# Altium schematic sheet 02.SchDoc
size 386 x 246 mm
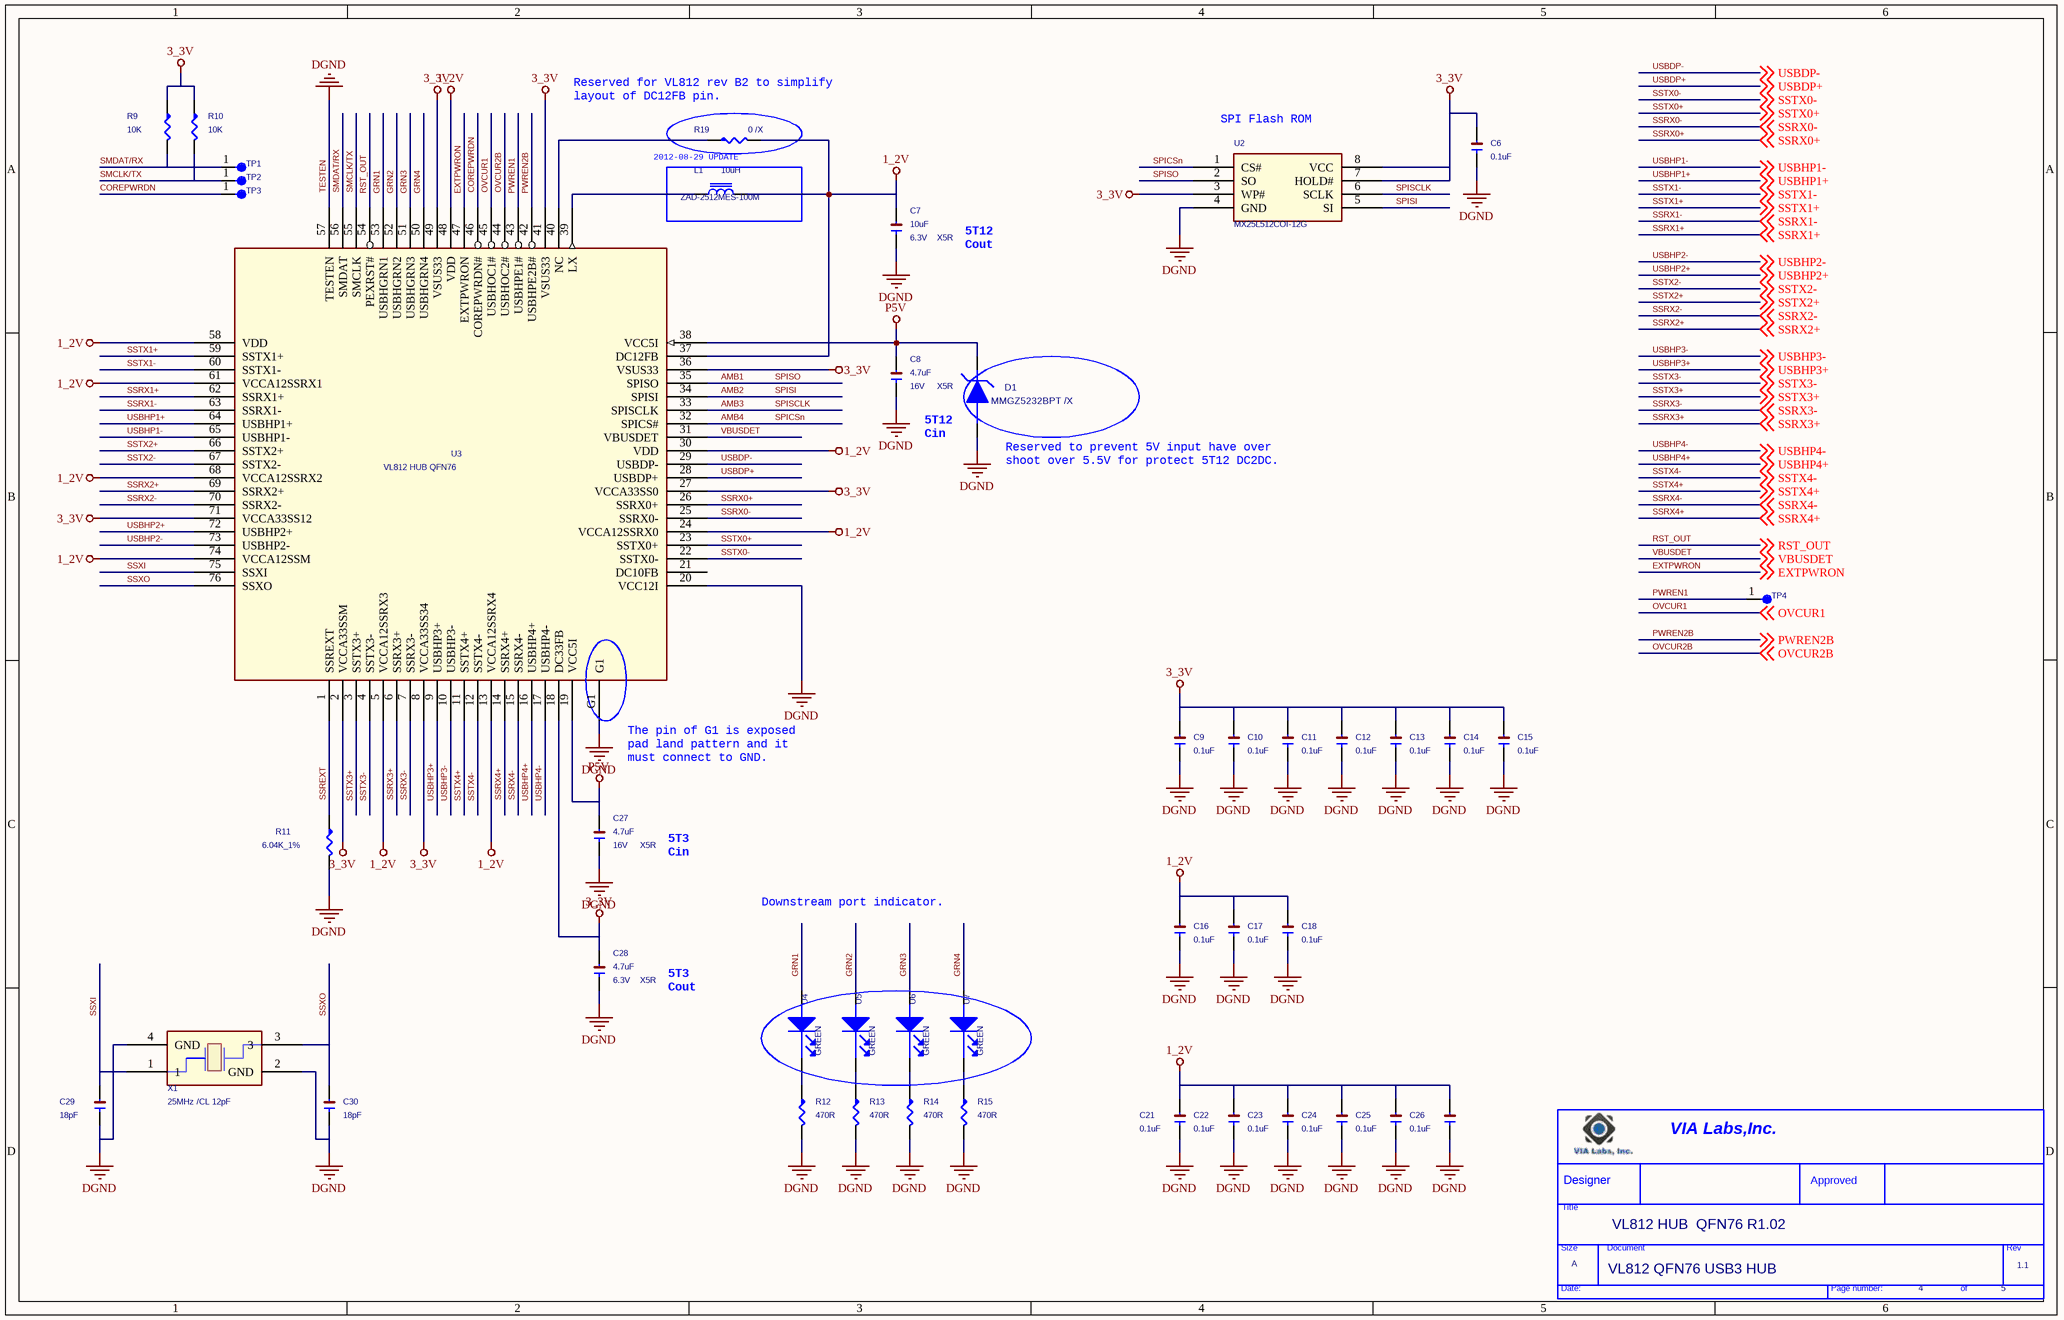
[diagram p0: 02.SchDoc]

## Parts
*  Page Count: 5  Page Number: 4  Page Size: A  Title: VL812 HUB  QFN76 R1.02  RevCode: 1.1  Doc: VL812 QFN76 USB3 HUB  (hidden comment: TitleBlock0)  (graphical)
C6  0.1uF  [1206]
C7  10uF  Dsc4: 6.3V  Dsc5: X5R  [1206]
C8  4.7uF  Dsc4: 16V  Dsc5: X5R  [1206]
C9  0.1uF  [1206]
C10  0.1uF  [1206]
C11  0.1uF  [1206]
C12  0.1uF  [1206]
C13  0.1uF  [1206]
C14  0.1uF  [1206]
C15  0.1uF  [1206]
C16  0.1uF  [1206]
C17  0.1uF  [1206]
C18  0.1uF  [1206]
C21  0.1uF  [1206]
C22  0.1uF  [1206]
C23  0.1uF  [1206]
C24  0.1uF  [1206]
C25  0.1uF  [1206]
C26  0.1uF  [1206]
C27  4.7uF  Dsc4: 16V  Dsc5: X5R  [1206]
C28  4.7uF  Dsc4: 6.3V  Dsc5: X5R  [1206]
C29  18pF  [1206]
C30  18pF  [1206]
D1  MMGZ5232BPT /X  [D-MELF]
L1  ZAD-2512MES-100M  Dsc3: 10uH  [L-ZAD2512]
R9  10K  [RES0402]
R10  10K  [RES0402]
R11  6.04K_1%  [RES0402]
R12  470R  [RES0402]
R13  470R  [RES0402]
R14  470R  [RES0402]
R15  470R  [RES0402]
R19  0 /X  [RES0402]
TP1  TestPoint  [smd_tp_1]  (value not drawn)
TP2  TestPoint  [smd_tp_1]  (value not drawn)
TP3  TestPoint  [smd_tp_1]  (value not drawn)
TP4  TestPoint  [smd_tp_1]  (value not drawn)
U2  MX25L512COI-12G  [TSSOP8-25P6X228]
U3  VL812 HUB QFN76  [QFN76]
U4  Dsc2: GREEN  [LED-LT8A23-51-UR96-T5]  (hidden comment: LT8A23-56-T5)
U5  Dsc2: GREEN  [LED-LT8A23-51-UR96-T5]  (hidden comment: LT8A23-56-T5)
U6  Dsc2: GREEN  [LED-LT8A23-51-UR96-T5]  (hidden comment: LT8A23-56-T5)
U7  Dsc2: GREEN  [LED-LT8A23-51-UR96-T5]  (hidden comment: LT8A23-56-T5)
X1  25MHz /CL 12pF  [OSC4-085X061]

## Nets
1_2V: C7.2 C16.2 C17.2 C18.2 C21.2 C22.2 C23.2 C24.2 C25.2 C26.2 L1.2 R19.2 U3.5(VCCA12SSRX3) U3.13(VCCA12SSRX4) U3.24(VCCA12SSRX0) U3.30(VDD) U3.37(DC12FB) U3.48(VDD) U3.58(VDD) U3.61(VCCA12SSRX1) U3.68(VCCA12SSRX2) U3.74(VCCA12SSM)
3_3V: C6.2 C9.2 C10.2 C11.2 C12.2 C13.2 C14.2 C15.2 C28.2 R9.1 R10.1 U2.3(WP#) U2.7(HOLD#) U2.8(VCC) U3.2(VCCA33SSM) U3.8(VCCA33SS34) U3.18(DC33FB) U3.27(VCCA33SS0) U3.36(VSUS33) U3.41(VSUS33) U3.49(VSUS33) U3.71(VCCA33SS12)
P5V: C8.2 C27.2 D1.K U3.19(VCC5I) U3.38(VCC5I)
TESTEN: C6.1 C7.1 C8.1 C9.1 C10.1 C11.1 C12.1 C13.1 C14.1 C15.1 C16.1 C17.1 C18.1 C21.1 C22.1 C23.1 C24.1 C25.1 C26.1 C27.1 C28.1 C29.1 C30.1 D1.A R11.2 R12.2 R13.2 R14.2 R15.2 U2.4(GND) U3.20(VCC12I) U3.57(TESTEN) U3.G1 X1.2(GND) X1.4(GND)  [also labelled DGND]
AMB1: U2.2(SO) U3.35(SPISO)  [also labelled SPISO]
AMB2: U2.5(SI) U3.34(SPISI)  [also labelled SPISI]
AMB3: U2.6(SCLK) U3.33(SPISCLK)  [also labelled SPISCLK]
AMB4: U2.1(CS#) U3.32(SPICS#)  [also labelled SPICSn]
COREPWRDN: TP3.1 U3.46(COREPWRDN#)
EXTPWRON: U3.47(EXTPWRON) ; off-sheet EXTPWRON
GRN1: U3.53(USBHGRN1) U4.1
GRN2: U3.52(USBHGRN2) U5.1
GRN3: U3.51(USBHGRN3) U6.1
GRN4: U3.50(USBHGRN4) U7.1
OVCUR1: U3.45(USBHOC1#) ; off-sheet OVCUR1
OVCUR2B: U3.44(USBHOC2#) ; off-sheet OVCUR2B
PWREN1: TP4.1 U3.43(USBHPE1#)
PWREN2B: U3.42(USBHPE2B#) ; off-sheet PWREN2B
RST_OUT: U3.54(PEXRST#) ; off-sheet RST_OUT
SMCLK/TX: R10.2 TP2.1 U3.55(SMCLK)
SMDAT/RX: R9.2 TP1.1 U3.56(SMDAT)
SSREXT: R11.1 U3.1(SSREXT)
SSRX0+: U3.26(SSRX0+) ; off-sheet SSRX0+
SSRX0-: U3.25(SSRX0-) ; off-sheet SSRX0-
SSRX1+: U3.62(SSRX1+) ; off-sheet SSRX1+
SSRX1-: U3.63(SSRX1-) ; off-sheet SSRX1-
SSRX2+: U3.69(SSRX2+) ; off-sheet SSRX2+
SSRX2-: U3.70(SSRX2-) ; off-sheet SSRX2-
SSRX3+: U3.6(SSRX3+) ; off-sheet SSRX3+
SSRX3-: U3.7(SSRX3-) ; off-sheet SSRX3-
SSRX4+: U3.14(SSRX4+) ; off-sheet SSRX4+
SSRX4-: U3.15(SSRX4-) ; off-sheet SSRX4-
SSTX0+: U3.23(SSTX0+) ; off-sheet SSTX0+
SSTX0-: U3.22(SSTX0-) ; off-sheet SSTX0-
SSTX1+: U3.59(SSTX1+) ; off-sheet SSTX1+
SSTX1-: U3.60(SSTX1-) ; off-sheet SSTX1-
SSTX2+: U3.66(SSTX2+) ; off-sheet SSTX2+
SSTX2-: U3.67(SSTX2-) ; off-sheet SSTX2-
SSTX3+: U3.3(SSTX3+) ; off-sheet SSTX3+
SSTX3-: U3.4(SSTX3-) ; off-sheet SSTX3-
SSTX4+: U3.11(SSTX4+) ; off-sheet SSTX4+
SSTX4-: U3.12(SSTX4-) ; off-sheet SSTX4-
SSXI: C29.2 U3.75(SSXI) X1.1
SSXO: C30.2 U3.76(SSXO) X1.3
USBDP+: U3.28(USBDP+) ; off-sheet USBDP+
USBDP-: U3.29(USBDP-) ; off-sheet USBDP-
USBHP1+: U3.64(USBHP1+) ; off-sheet USBHP1+
USBHP1-: U3.65(USBHP1-) ; off-sheet USBHP1-
USBHP2+: U3.72(USBHP2+) ; off-sheet USBHP2+
USBHP2-: U3.73(USBHP2-) ; off-sheet USBHP2-
USBHP3+: U3.9(USBHP3+) ; off-sheet USBHP3+
USBHP3-: U3.10(USBHP3-) ; off-sheet USBHP3-
USBHP4+: U3.16(USBHP4+) ; off-sheet USBHP4+
USBHP4-: U3.17(USBHP4-) ; off-sheet USBHP4-
VBUSDET: U3.31(VBUSDET) ; off-sheet VBUSDET
NetL1_1: L1.1 U3.39(LX)
NetR12_1: R12.1 U4.2
NetR13_1: R13.1 U5.2
NetR14_1: R14.1 U6.2
NetR15_1: R15.1 U7.2
NetR19_1: R19.1 U3.40(NC)

Not connected (* = marked no-connect by the designer): U3 21(DC10FB)

## Notes on the sheet
- (near R19) Reserved for VL812 rev B2 to simplify
  layout of DC12FB pin.
- (near U2) SPI Flash ROM
- (near R19) 2012-08-29 UPDATE
- 5T12
  Cout
- (near D1) 5T12
  Cin
- (near D1) Reserved to prevent 5V input have over
  shoot over 5.5V for protect 5T12 DC2DC.
- The pin of G1 is exposed
  pad land pattern and it
  must connect to GND.
- 5T3
  Cin
- Downstream port indicator.
- 5T3
  Cout
- (in symbol TitleBlock0) VIA Labs,Inc.; Designer; Approved; Title; Size; Document; Rev; Date:; Page number:; of

## Library data of the parts
C6 = C: Part Number: 99G12-006525; DSCX: CAP ML 0.1 uF K 16V X5R SMT0402,THICKNESS=0.50mm EMK105BJ104KV TAIYO; ID: 16,890; 弧: CAP ML0.1 uFZ16VY5VSMT0402,THICKNESS=0.50∮0.05mmCC; approval status: A; Dsc1: CAP ML; Dsc3: K; Dsc4: 16V; Dsc5: X5R; Dsc6: SMT0402,THICKNESS=0.50mm; Dsc7: EMK105BJ104KV; Dsc8: TAIYO; Qualify: YES; QUAN: 34,490; Date: 12302002; Dsc2: 0.1 uF; Part Type: SMD CAP; Cost: 0
C7 = C: Part Number: 99G12-001175; ID: 17560; 弧: CAP ML 10 uF M 6.3V X5R SMT060; approval status: A; Dsc1: CAP ML; Dsc3: M; Dsc6: SMT0603,THICKNESS=0.80mm; Dsc7: JMK107BJ106MA-T; Dsc8: TAIYO; Qualify: YES; QUAN: 4660; DSCX: CAP ML 10 uF M 6.3V X5R SMT0603,THICKNESS=0.80mm JMK107BJ106MA-T TAIYO; Date: 12302002; Dsc2: 10 uF; Part Type: SMD CAP; Cost: 0.05
C8 C27 = C: Part Number: 99G12-000775; ID: 17514; 弧: CAP ML 4.7 uF K 16V X5R SMT080; approval status: CA; Dsc1: CAP ML; Dsc3: K; Dsc6: SMT0805,THICKNESS=1.25mm; Dsc7: EMK212BJ475KG-T; Dsc8: TAIYO; Qualify: YES; QUAN: 2820; DSCX: CAP ML 4.7 uF K 16V X5R SMT0805,THICKNESS=1.25mm EMK212BJ475KG-T TAIYO; Date: 12302002; Dsc2: 4.7 uF; Part Type: SMD CAP; Cost: 0.02
C9-C14 C21-C26 = C: Part Number: 99G12-006525; ID: 16,890; 弧: CAP ML0.1 uFZ16VY5VSMT0402,THICKNESS=0.50∮0.05mmCC; approval status: A; Dsc1: CAP ML; Dsc3: K; Dsc4: 16V; Dsc5: X5R; Dsc6: SMT0402,THICKNESS=0.50mm; Dsc7: EMK105BJ104KV; Dsc8: TAIYO; Qualify: YES; QUAN: 34,490; DSCX: CAP ML 0.1 uF K 16V X5R SMT0402,THICKNESS=0.50mm EMK105BJ104KV TAIYO; Date: 12302002; Dsc2: 0.1 uF; Part Type: SMD CAP; Cost: 0
C15-C18 = C: Part Number: 99G12-006525; QUAN: 34,490; Qualify: YES; Dsc8: TAIYO; Dsc7: EMK105BJ104KV; Dsc6: SMT0402,THICKNESS=0.50mm; Dsc5: X5R; Dsc4: 16V; Dsc3: K; Dsc1: CAP ML; approval status: A; 弧: CAP ML0.1 uFZ16VY5VSMT0402,THICKNESS=0.50∮0.05mmCC; ID: 16,890; DSCX: CAP ML 0.1 uF K 16V X5R SMT0402,THICKNESS=0.50mm EMK105BJ104KV TAIYO; Date: 12302002; Cost: 0; Part Type: SMD CAP; Dsc2: 0.1 uF
C28 = C: Part Number: 99G12-000636; ID: 17494; 弧: CAP ML4.7 uFK6.3VX5RSMT0603,THICKNESS=0.80∮0.10mmC; approval status: NA; Dsc1: CAP ML; Dsc3: K; Dsc6: SMT0603,THICKNESS=0.80∮0.10mm; Dsc7: CC0603KRX5R5BB475; Dsc8: YAGEO; Qualify: YES; QUAN: 2261; DSCX: CAP ML 4.7 uF K 6.3V X5R SMT0603,THICKNESS=0.80∮0.10mm CC0603KRX5R5BB475 YAGEO; Date: 12302002; Dsc2: 4.7 uF; Part Type: SMD CAP; Cost: 0.02
C29 C30 = C: Part Number: 99G12-00478B; ID: 16,794; 弧: CAP ML 18 pF J 50V NPO SMT0402; approval status: A; Dsc1: CAP ML; Dsc3: J; Dsc4: 50V; Dsc5: NPO; Dsc6: SMT0402,THICKNESS=0.50∮0.05mm; Dsc7: C1005NP0180JGT; Dsc8: DARFON; Qualify: YES; QUAN: 147,635; DSCX: CAP ML 18 pF J 50V NPO SMT0402,THICKNESS=0.50∮0.05mm C1005NP0180JGT DARFON; Date: 12302002; Dsc2: 18 pF; Part Type: SMD CAP; Cost: 0
D1 = SS22_0: PART DESC: 2A 20V Schottky Rectifier; OriginalSymbolOrigin: (96,200); HETERO: DIOZ-H,(DIOZ-V); MFG: FAIRCHILD; REF: SS22
L1 = INDUCTOR: ID: 9302; 弧: INDUCTOR SPC-04702-100 10uH N; approval status: PL; Dsc2: SPC-04702-100; Dsc4: N; Dsc5: 1.02A; Dsc6: 4.7*4.7*2mm; Dsc8: TMP; Qualify: YES; Approval Sheet: \\tp_mi05\BackUp\VPSD\Data Sheet\Data Sheet\99-23-03\99-23-02193G.pdf; QUAN: 0; Date: 12302002; Dsc1: INDUCTOR; Part Type: SMD INDUCTOR; Cost: 0.21
R9 R10 = R: Part Number: 99G19-001453; DSCX: RES CHIP 10K OHM J 1/16W CF SMT0402,THICKNESS=0.35∮0.05mm RC0402JR-0710KL YAGEO; ID: 17,537; 弧: RES CHIP 10K OHM J 1/10W CF SM; approval status: NA; Dsc1: RES CHIP; Dsc2: 10K OHM; Dsc3: J; Dsc4: 1/16W; Dsc5: CF; Dsc6: SMT0402,THICKNESS=0.35∮0.05mm; Dsc7: RC0402JR-0710KL; Dsc8: YAGEO; Qualify: YES; QUAN: 15,463; Date: 12302002; Part Type: SMD RES; Cost: 0
R11 = R: Part Number: 99G20-007211; QUAN: 61,736; Qualify: YES; Dsc8: YAGEO; Dsc7: RC0402JR-075K1L; Dsc6: SMT0402,THICKNESS=0.35∮0.05mm; Dsc5: CF; Dsc4: 1/16W; Dsc3: F; Dsc2: 6.04K OHM; Dsc1: RES CHIP; approval status: PL; 弧: RES CHIP 5.1K OHM J 1/16W CF S; ID: 18,915; DSCX: RES CHIP 5.1K OHM J 1/16W CF SMT0402,THICKNESS=0.35∮0.05mm RC0402JR-075K1L YAGEO; Date: 12302002; Cost: 0; Part Type: SMD RES
R12-R15 = R: Part Number: 99G19-001583; QUAN: 66,132; Qualify: YES; Dsc8: YAGEO; Dsc7: RC0402JR-07470RL; Dsc6: SMT0402,THICKNESS=0.35∮0.05mm; Dsc5: CF; Dsc4: 1/16W; Dsc3: J; Dsc2: 470 OHM; Dsc1: RES CHIP; approval status: PL; 弧: RES CHIP 470 OHM J 1/16W CF SM; ID: 17,562; DSCX: RES CHIP 470 OHM J 1/16W CF SMT0402,THICKNESS=0.35∮0.05mm RC0402JR-07470RL YAGEO; Date: 12302002; Cost: 0; Part Type: SMD RES
R19 = R: Part Number: 99G19-001423; ID: 17,528; 弧: RES CHIP 0 OHM J 1/16W CF SMT0; approval status: NA; Dsc1: RES CHIP; Dsc2: 0 OHM; Dsc3: J; Dsc4: 1/16W; Dsc5: CF; Dsc6: SMT0402,THICKNESS=0.35∮0.05mm; Dsc7: RC0402JR-070RL; Dsc8: YAGEO; Qualify: YES; QUAN: 6,104; DSCX: RES CHIP 0 OHM J 1/16W CF SMT0402,THICKNESS=0.35∮0.05mm RC0402JR-070RL YAGEO; Date: 12302002; Part Type: SMD RES; Cost: 0
TP1-TP4 = TestPoint: Part Number: CAD; Date: 12302002
U2 = MX25L512COI-12G: Part Number: 99G02-06215D; ID: 12913; 弧: IC FLASH ROM MX25L512COI-12G 5; approval status: PL; Dsc1: IC FLASH ROM; Dsc3: 512Kbit; Dsc4: TSSOP; Dsc5: 8PIN; Dsc8: MXIC; Qualify: YES; QUAN: 0; Date: 04282009; Dsc2: MX25L512COI-12G; Part Type: SMD IC; Cost: 0.00
U3 = VT3470 HUB QFN76_V1_4.02
U4-U7 = LED-LT8A23-51-UR96-T5: Part Number: 99G11-010351; CLASS: IC; QUAN: 2830; Approval Sheet: \\tp_mi05\BackUp\VPSD\Data Sheet\Data Sheet\99G\99G11-01\99G11-010351.pdf; Qualify: YES; Dsc8: 地砍; Dsc5: 2PAD; Dsc4: SMT0603; Dsc1: LED LAMP; approval status: CA; 弧: LED LAMP GREEN LT8A23-56-T5 SM; ID: 14466; Date: 08022006; Cost: 0.03; Part Type: SMD LED; Dsc3: LT8A23-56-T5
X1 = SMD_CRYSTAL_0: Part Number: 99G08-032284; ID: 15770; 弧: CRYSTAL 25MHZ ∮30PPM X3S025000; approval status: PL; Dsc3: ∮30PPM; Dsc4: X3S025000FC1H-X; Dsc5: 12PF/RR=60 OHM MAX; Dsc6: 3.2mm*2.5mm*0.7mm; Dsc7: SMD/4PAD; Dsc8: KDS(H.ELE.); Qualify: YES; QUAN: 0; DSCX: CRYSTAL 25MHZ ∮30PPM X3S025000FC1H-X 12PF/RR=60 OHM MAX 3.2mm*2.5mm*0.7mm SMD/4PAD KDS(H.ELE.); Date: 10212004; Dsc1: CRYSTAL; Dsc2: 25MHZ; Part Type: SMD CRYSTAL; Cost: 0.00
* = TitleBlock0: Page Create Date: March  8, 1995